# EAGLE design Pulsoxy (EAGLE 9.3.1)
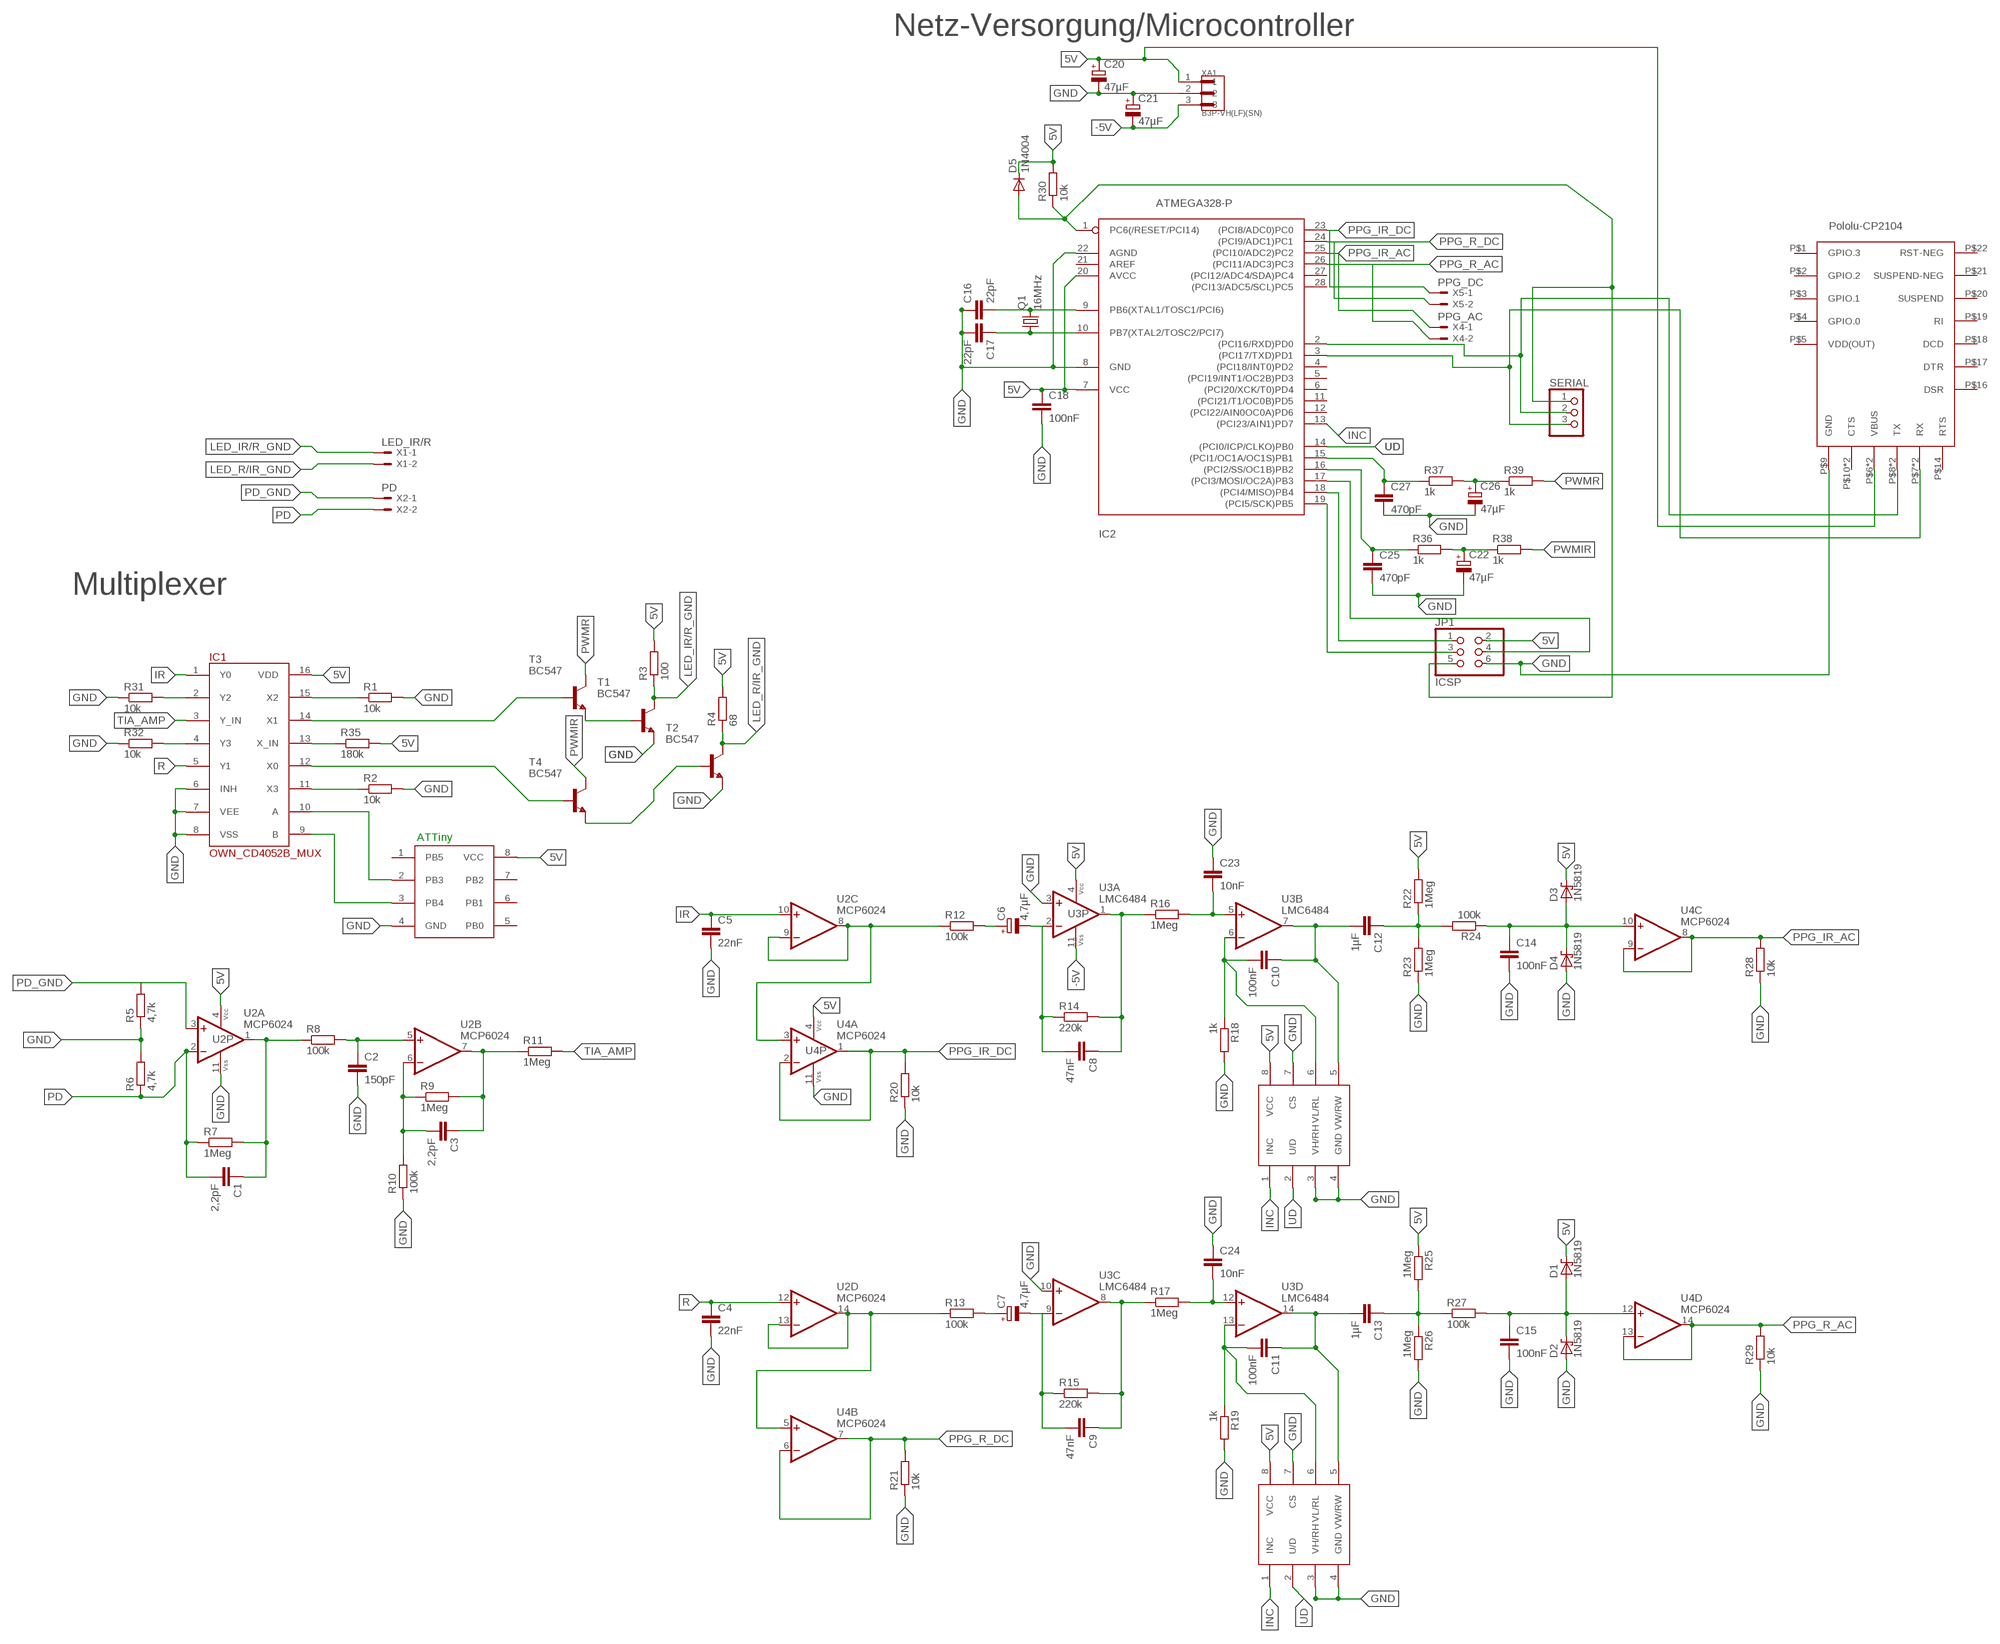
[diagram p0: schematic, sheet 1]

## Parts
ATTINY  ATTINY85  [DIL08]
C1  2,2pF  C-EU025-024X044  [C025-024X044]
C2  150pF  C-EU025-024X044  [C025-024X044]
C3  2,2pF  C-EU025-024X044  [C025-024X044]
C4  22nF  C-EU025-024X044  [C025-024X044]
C5  22nF  C-EU025-024X044  [C025-024X044]
C6  4,7µF  CPOL-EUE2-5  [E2-5]
C7  4,7µF  CPOL-EUE2-5  [E2-5]
C8  47nF  C-EU025-024X044  [C025-024X044]
C9  47nF  C-EU025-024X044  [C025-024X044]
C10  100nF  C-EU025-024X044  [C025-024X044]
C11  100nF  C-EU025-024X044  [C025-024X044]
C12  1µF  C-EU150-064X183  [C150-064X183]
C13  1µF  C-EU150-064X183  [C150-064X183]
C14  100nF  C-EU025-024X044  [C025-024X044]
C15  100nF  C-EU025-024X044  [C025-024X044]
C16  22pF  C-EU025-024X044  [C025-024X044]
C17  22pF  C-EU025-024X044  [C025-024X044]
C18  100nF  C-EU025-024X044  [C025-024X044]
C20  47µF  CPOL-EUE2,5-6E  [E2,5-6E]
C21  47µF  CPOL-EUE2,5-6E  [E2,5-6E]
C22  47µF  CPOL-EUE2,5-6E  [E2,5-6E]
C23  10nF  C-EU025-024X044  [C025-024X044]
C24  10nF  C-EU025-024X044  [C025-024X044]
C25  470pF  C-EU025-024X044  [C025-024X044]
C26  47µF  CPOL-EUE2,5-6E  [E2,5-6E]
C27  470pF  C-EU025-024X044  [C025-024X044]
D1  1N5819  SCHOTTKY-DIODEF126Z12  [F126Z12]
D2  1N5819  SCHOTTKY-DIODEF126Z12  [F126Z12]
D3  1N5819  SCHOTTKY-DIODEF126Z12  [F126Z12]
D4  1N5819  SCHOTTKY-DIODEF126Z12  [F126Z12]
D5  1N4004  [DO41-10]
IC1  OWN_CD4052B_MUX  [DIL16]
IC2  ATMEGA328-P  ATMEGA168-20P  [DIL28-3]
JP1  ICSP  PINHD-2X3  [2X03]
Q1  16MHz  CRYSTALHC49U70  [HC49U70]
R1  10k  R-EU_0204/7  [0204/7]
R2  10k  R-EU_0204/7  [0204/7]
R3  100  R-EU_0204/7  [0204/7]
R4  68  R-EU_0204/7  [0204/7]
R5  4,7k  R-EU_0204/7  [0204/7]
R6  4,7k  R-EU_0204/7  [0204/7]
R7  1Meg  R-EU_0204/7  [0204/7]
R8  100k  R-EU_0204/7  [0204/7]
R9  1Meg  R-EU_0204/7  [0204/7]
R10  100k  R-EU_0204/7  [0204/7]
R11  1Meg  R-EU_0204/7  [0204/7]
R12  100k  R-EU_0204/7  [0204/7]
R13  100k  R-EU_0204/7  [0204/7]
R14  220k  R-EU_0204/7  [0204/7]
R15  220k  R-EU_0204/7  [0204/7]
R16  1Meg  R-EU_0204/7  [0204/7]
R17  1Meg  R-EU_0204/7  [0204/7]
R18  1k  R-EU_0204/7  [0204/7]
R19  1k  R-EU_0204/7  [0204/7]
R20  10k  R-EU_0204/7  [0204/7]
R21  10k  R-EU_0204/7  [0204/7]
R22  1Meg  R-EU_0204/7  [0204/7]
R23  1Meg  R-EU_0204/7  [0204/7]
R24  100k  R-EU_0204/7  [0204/7]
R25  1Meg  R-EU_0204/7  [0204/7]
R26  1Meg  R-EU_0204/7  [0204/7]
R27  100k  R-EU_0204/7  [0204/7]
R28  10k  R-EU_0204/7  [0204/7]
R29  10k  R-EU_0204/7  [0204/7]
R30  10k  R-EU_0204/7  [0204/7]
R31  10k  R-EU_0204/7  [0204/7]
R32  10k  R-EU_0204/7  [0204/7]
R35  180k  R-EU_0204/7  [0204/7]
R36  1k  R-EU_0204/7  [0204/7]
R37  1k  R-EU_0204/7  [0204/7]
R38  1k  R-EU_0204/7  [0204/7]
R39  1k  R-EU_0204/7  [0204/7]
SERIAL  PINHD-1X3  [1X03]
T1  BC547  [TO92]
T2  BC547  [TO92]
T3  BC547  [TO92]
T4  BC547  [TO92]
U2  MCP6024  LMV824  [DIL14]
U3  LMC6484  LMV824  [DIL14]
U4  MCP6024  LMV824  [DIL14]
U$1  X9C104P  [DIL08]
U$2  X9C104P  [DIL08]
U$3  POLOLU_CP2104  [POLOLUCP2104]
X1  LED_IR/R  JST-XH-02-PIN-LONG-PAD  [JST-XH-02-PACKAGE-LONG-PAD]
X2  PD  JST-XH-02-PIN-LONG-PAD  [JST-XH-02-PACKAGE-LONG-PAD]
X4  PPG_AC  JST-XH-02-PIN-LONG-PAD  [JST-XH-02-PACKAGE-LONG-PAD]
X5  PPG_DC  JST-XH-02-PIN-LONG-PAD  [JST-XH-02-PACKAGE-LONG-PAD]
XA1  B3P-VH(LF)(SN)  [JST_B3P-VH(LF)(SN)]

## Nets
5V [supply]: ATTINY.8(VCC) C18.1 C20.+ D1.C D3.C D5.C IC1.16(VDD) IC2.7(VCC) IC2.20(AVCC) JP1.2 R3.2 R4.2 R22.2 R25.1 R30.2 R35.2 U2.4(P:VCC+) U3.4(P:VCC+) U4.4(P:VCC+) U$1.8(VCC) U$2.8(VCC) U$3.P$6(VBUS) U$3.P$11(VBUS) XA1.1
-5V [supply]: C21.- U3.11(P:VCC-) XA1.3
GND [supply]: ATTINY.4(GND) C2.2 C4.2 C5.2 C14.2 C15.2 C16.1 C17.2 C18.2 C20.- C21.+ C22.- C23.1 C24.1 C25.2 C26.- C27.2 D2.A D4.A IC1.6(INH) IC1.7(VEE) IC1.8(VSS) IC2.8(GND) IC2.22(AGND) JP1.6 R1.2 R2.2 R5.1 R6.2 R10.1 R18.2 R19.2 R20.1 R21.1 R23.1 R26.2 R28.1 R29.1 R31.1 R32.1 T1.1(E) T2.1(E) U2.11(P:VCC-) U3.3(A:+IN) U3.10(C:+IN) U4.11(P:VCC-) U$1.3(VH/RH) U$1.4(GND) U$1.7(CS) U$2.3(VH/RH) U$2.4(GND) U$2.7(CS) U$3.P$9(GND) XA1.2
INC: IC2.13((PCI23/AIN1)PD7) U$1.1(INC) U$2.1(INC)
IR: C5.1 IC1.1(Y0) U2.10(C:+IN)
LED_IR/R_GND: R3.1 T1.3(C) X1.1
LED_R/IR_GND: R4.1 T2.3(C) X1.2
N$1: IC1.11(X3) R2.1
N$2: IC1.15(X2) R1.1
N$3: IC1.14(X1) T3.2(B)
N$4: IC1.12(X0) T4.2(B)
N$5: C1.1 R7.2 R8.1 U2.1(A:OUT)
N$6: C2.1 R8.2 U2.5(B:+IN)
N$7: C3.2 R9.1 R10.2 U2.6(B:-IN)
N$8: C3.1 R9.2 R11.1 U2.7(B:OUT)
N$9: R12.1 U2.8(C:OUT) U2.9(C:-IN) U4.3(A:+IN)
N$10: R13.1 U2.13(D:-IN) U2.14(D:OUT) U4.5(B:+IN)
N$11: ATTINY.2(PB3) IC1.10(A)
N$12: ATTINY.3(PB4) IC1.9(B)
N$13: C7.- C9.2 R15.1 U3.9(C:-IN)
N$14: C8.1 R14.2 R16.1 U3.1(A:OUT)
N$15: C6.- C8.2 R14.1 U3.2(A:-IN)
N$16: C9.1 R15.2 R17.1 U3.8(C:OUT)
N$17: C13.1 R25.2 R26.1 R27.1
N$18: C14.1 D3.A D4.C R24.1 U4.10(C:+IN)
N$19: C10.2 R18.1 U3.6(B:-IN) U$1.6(VL/RL)
N$20: C15.1 D1.A D2.C R27.2 U4.12(D:+IN)
N$21: C11.2 R19.1 U3.13(D:-IN) U$2.6(VL/RL)
N$22: IC1.4(Y3) R32.2
N$23: C10.1 C12.2 U3.7(B:OUT) U$1.5(VW/RW)
N$24: C12.1 R22.1 R23.2 R24.2
N$25: C11.1 C13.2 U3.14(D:OUT) U$2.5(VW/RW)
N$26: C16.2 IC2.9(PB6(XTAL1/TOSC1/PCI6)) Q1.2
N$27: C17.1 IC2.10(PB7(XTAL2/TOSC2/PCI7)) Q1.1
N$28: IC2.2((PCI16/RXD)PD0) SERIAL.2 U$3.P$8(TX) U$3.P$12(TX)
N$29: D5.A IC2.1(PC6(/RESET/PCI14)) JP1.5 R30.1 SERIAL.1
N$30: IC2.18((PCI4/MISO)PB4) JP1.1
N$31: IC2.19((PCI5/SCK)PB5) JP1.3
N$32: IC2.17((PCI3/MOSI/OC2A)PB3) JP1.4
N$33: IC1.2(Y2) R31.2
N$35: IC2.3((PCI17/TXD)PD1) SERIAL.3 U$3.P$7(RX) U$3.P$13(RX)
N$42: C24.2 R17.2 U3.12(D:+IN)
N$43: IC1.13(X_IN) R35.1
N$44: C25.1 IC2.16((PCI2/SS/OC1B)PB2) R36.1
N$45: C23.2 R16.2 U3.5(B:+IN)
N$46: C7.+ R13.2
N$47: C6.+ R12.2
N$49: T1.2(B) T3.1(E)
N$50: T2.2(B) T4.1(E)
N$51: C22.+ R36.2 R38.1
N$52: C27.1 IC2.15((PCI1/OC1A/OC1S)PB1) R37.1
N$53: C26.+ R37.2 R39.1
PD: C1.2 R6.1 R7.1 U2.2(A:-IN) X2.2
PD_GND: R5.2 U2.3(A:+IN) X2.1
PPG_IR_AC: IC2.25((PCI10/ADC2)PC2) R28.2 U4.8(C:OUT) U4.9(C:-IN) X4.1
PPG_IR_DC: IC2.23((PCI8/ADC0)PC0) R20.2 U4.1(A:OUT) U4.2(A:-IN) X5.1
PPG_R_AC: IC2.26((PCI11/ADC3)PC3) R29.2 U4.13(D:-IN) U4.14(D:OUT) X4.2
PPG_R_DC: IC2.24((PCI9/ADC1)PC1) R21.2 U4.6(B:-IN) U4.7(B:OUT) X5.2
PWMIR: R38.2 T4.3(C)
PWMR: R39.2 T3.3(C)
R: C4.1 IC1.5(Y1) U2.12(D:+IN)
TIA_AMP: IC1.3(Y_IN) R11.2
UD: IC2.14((PCI0/ICP/CLKO)PB0) U$1.2(U/D) U$2.2(U/D)
Unconnected: ATTINY.1(PB5) ATTINY.5(PB0) ATTINY.6(PB1) ATTINY.7(PB2) IC2.4((PCI18/INT0)PD2) IC2.5((PCI19/INT1/OC2B)PD3) IC2.6((PCI20/XCK/T0)PD4) IC2.11((PCI21/T1/OC0B)PD5) IC2.12((PCI22/AIN0OC0A)PD6) IC2.21(AREF) IC2.27((PCI12/ADC4/SDA)PC4) IC2.28((PCI13/ADC5/SCL)PC5) U$3.P$1(GPIO.3) U$3.P$2(GPIO.2) U$3.P$3(GPIO.1) U$3.P$4(GPIO.0) U$3.P$10(CTS) U$3.P$14(RTS) U$3.P$15(CTS) U$3.P$16(DSR) U$3.P$17(DTR) U$3.P$18(DCD) U$3.P$19(RI) U$3.P$20(SUSPEND) U$3.P$21(SUSPEND-NEG) U$3.P$22(RST-NEG)

## Notes on the sheet
- Netz-Versorgung/Microcontroller
- Multiplexer
- ATTiny

## Power pins joined to a net without a drawn wire
VDD(OUT): U$3.P$5(VDD(OUT))

## Library data of the parts
ATTINY = ATTINY85:ATTINY85; SPICEPREFIX: X
C1-C5 C8-C18 C23-C25 C27 = rcl:C-EU: CAPACITOR, European symbol; SPICEPREFIX: C
C6 C7 C20-C22 C26 = rcl:CPOL-EU: POLARIZED CAPACITOR, European symbol; SPICEPREFIX: C
D1-D4 = diode:SCHOTTKY-DIODE: Schottky Diode
D5 = diode:1N4004: DIODE general purpose rectifier, 1 A
IC1 = OWN_CD4052B_MUX:OWN_CD4052B_MUX
IC2 = adafruit:ATMEGA168*P: MICROCONTROLLER 16 kBytes FLASH 1 kBytes SRAM 512 Bytes EEPROM USART 8-channel 10 bit ADC
JP1 = pinhead:PINHD-2X3: PIN HEADER
Q1 = adafruit:CRYSTAL: CRYSTAL; OC_FARNELL: unknown; OC_NEWARK: unknown
R1-R32 R35-R39 = rcl:R-EU_: RESISTOR, European symbol; SPICEPREFIX: R
SERIAL = pinhead:PINHD-1X3: PIN HEADER
T1-T4 = transistor:BC547: NPN TRANSISTOR
U2-U4 = op-amp:LMV824: OP-AMP - Low Voltage Rail-to-Rail
U$1 U$2 = X9C104P:X9C104P
U$3 = POLOLU_CP2104:POLOLU_CP2104: TTL zu USB Konverter
X1 X2 X4 X5 = Rembrandt Electronics - JST XH Connectors v1-0:JST-XH-02-PIN: JST XH Connector 2 Pin Wire to board connector. Pitch: 2,54 mm, (0.100") Number of pins: 2 Created by Rembrandt Electronics www.rembrandtelectronics.com
XA1 = B3P-VH_LF__SN_:B3P-VH(LF)(SN): VH Series 3 Position 3.96 mm Pitch Through Hole Crimp Locking Header; AVAILABILITY: Good; DESCRIPTION: VH Series 3 Position 3.96 mm Pitch Through Hole Crimp Locking Header; MF: JST; MP: B3P-VH_LF__SN_; PACKAGE: FakePackage u; PRICE: 0.12 USD

## Net classes
0 signals: width 0.406 mm, clearance 0.305 mm
1 supply: width 0.61 mm, clearance 0.406 mm

## Board
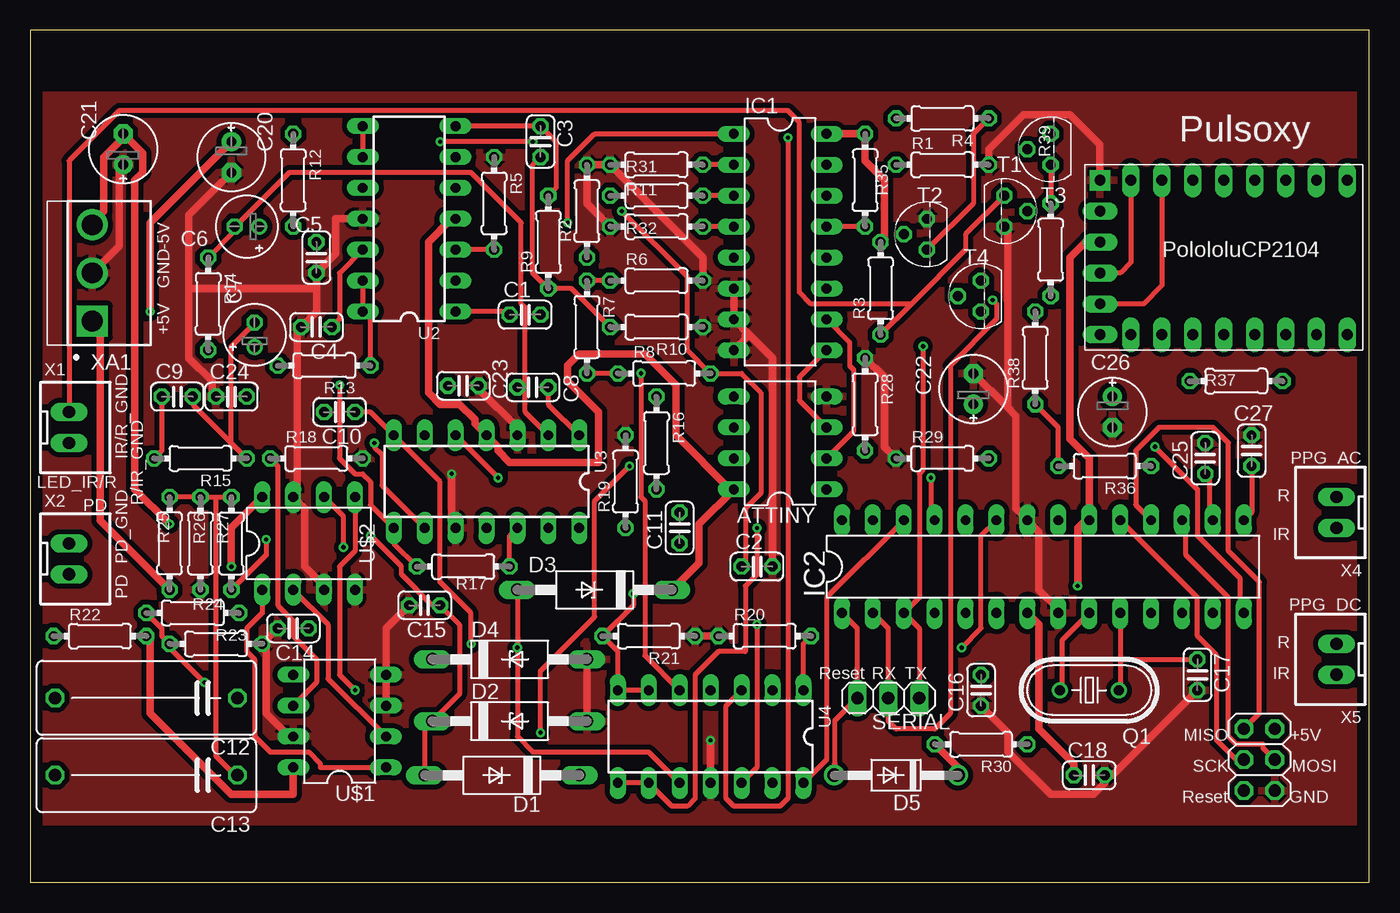
[diagram p1: board, top side]
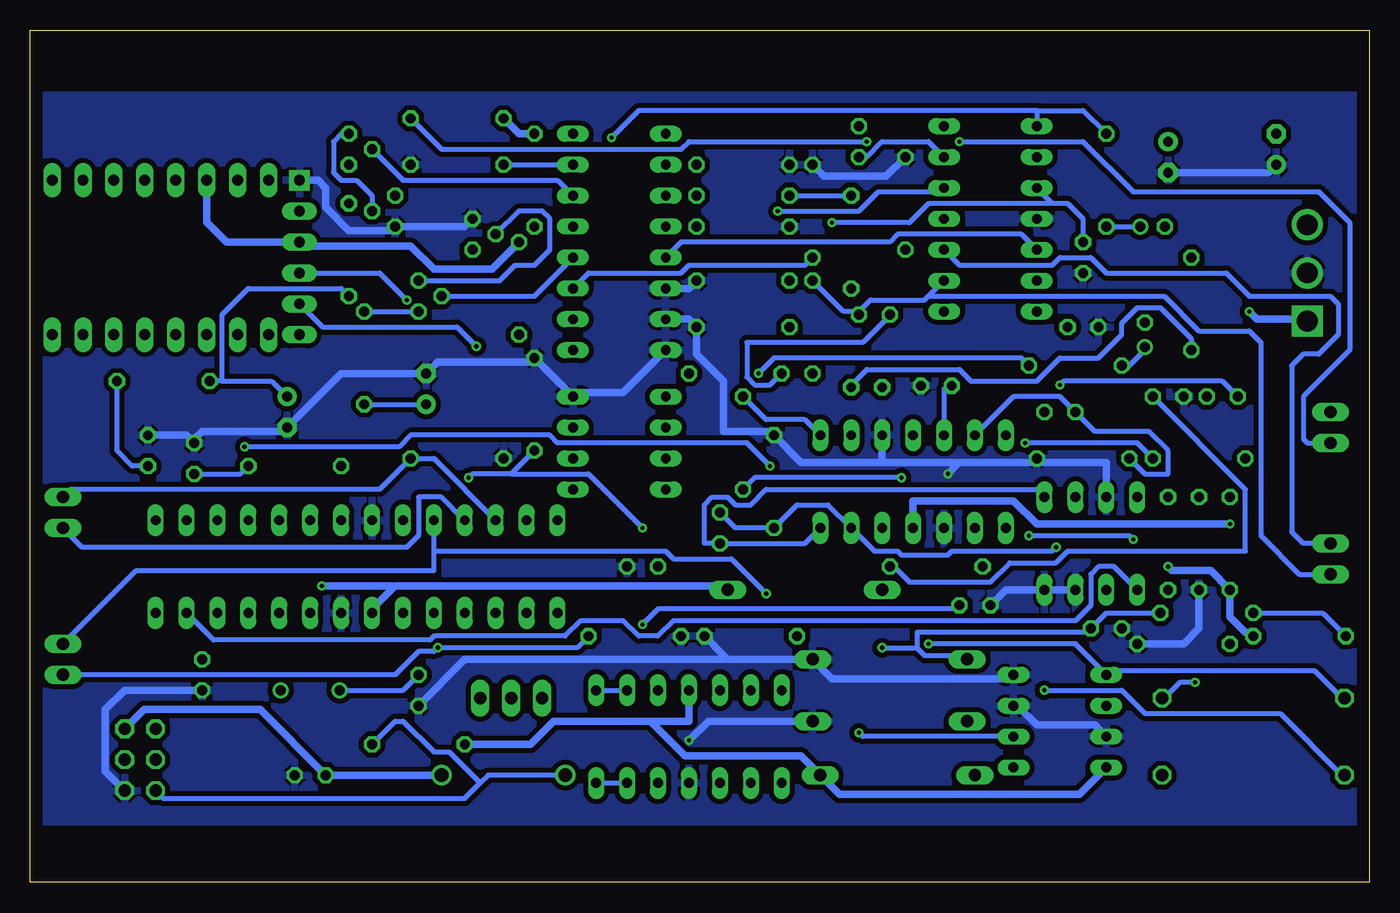
[diagram p2: board, bottom side, seen from below]

Size 109.98 x 70.01 mm. Coordinates in mm from the lower left corner, seen from the top.
Outline: 0,0 109.98,0 109.98,70.01 0,70.01 0,0
Copper layers (1*16): Top 0.035mm / dielectric 1.5mm / Bottom 0.035mm
Design rules "default": minimum track width 6mil, minimum drill 0.35mm, track to track 6mil, track to pad 6mil, pad to pad 6mil, via to via 6mil, smd to smd 6mil, copper to edge 40mil, drill to drill 6mil, minimum pad ring 10mil, minimum via ring 8mil, stop-mask expansion 4mil, vias tented up to drill 0mil, thermal gap 10mil

### Footprints (pad centres in the part's own frame; a part is rotated, then mirrored left to right if it is on the bottom)
DIL08 = drill 0.813 long: 1 -2.54,-3.81; 2 0,-3.81; 3 2.54,-3.81; 4 5.08,-3.81; 5 5.08,3.81; 6 2.54,3.81; 7 0,3.81; 8 -2.54,3.81
C025-024X044 = drill 0.813 octagon: 1 -1.27,0; 2 1.27,0
E2-5 = drill 0.813 pad 1.27: + -1.016,0 | drill 0.813 pad 1.27 octagon: - 1.016,0
C150-064X183 = drill 1.016 octagon: 1 -7.493,0; 2 7.493,0
E2,5-6E = drill 0.813 pad 1.575: + -1.27,0 | drill 0.813 pad 1.575 octagon: - 1.27,0
F126Z12 = drill 1.016 long: A 6.35,0; C -6.35,0
DO41-10 = drill 1.118: A 5.08,0; C -5.08,0
DIL16 = drill 0.813 long: 1 -8.89,-3.81; 2 -6.35,-3.81; 3 -3.81,-3.81; 4 -1.27,-3.81; 5 1.27,-3.81; 6 3.81,-3.81; 7 6.35,-3.81; 8 8.89,-3.81; 9 8.89,3.81; 10 6.35,3.81; 11 3.81,3.81; 12 1.27,3.81; 13 -1.27,3.81; 14 -3.81,3.81; 15 -6.35,3.81; 16 -8.89,3.81
DIL28-3 = drill 0.813 long: 1 -16.51,-3.81; 2 -13.97,-3.81; 3 -11.43,-3.81; 4 -8.89,-3.81; 5 -6.35,-3.81; 6 -3.81,-3.81; 7 -1.27,-3.81; 8 1.27,-3.81; 9 3.81,-3.81; 10 6.35,-3.81; 11 8.89,-3.81; 12 11.43,-3.81; 13 13.97,-3.81; 14 16.51,-3.81; 15 16.51,3.81; 16 13.97,3.81; 17 11.43,3.81; 18 8.89,3.81; 19 6.35,3.81; 20 3.81,3.81; 21 1.27,3.81; 22 -1.27,3.81; 23 -3.81,3.81; 24 -6.35,3.81; 25 -8.89,3.81; 26 -11.43,3.81; 27 -13.97,3.81; 28 -16.51,3.81
2X03 = drill 1.016 octagon: 1 -2.54,-1.27; 2 -2.54,1.27; 3 0,-1.27; 4 0,1.27; 5 2.54,-1.27; 6 2.54,1.27
HC49U70 = drill 0.813: 1 -2.413,0; 2 2.413,0
0204/7 = drill 0.813 octagon: 1 -3.81,0; 2 3.81,0
1X03 = drill 1.016 long: 1 -2.54,0; 2 0,0; 3 2.54,0
TO92 = drill 0.813 octagon: 1 1.27,0; 2 0,1.905; 3 -1.27,0
DIL14 = drill 0.813 long: 1 -7.62,-3.81; 2 -5.08,-3.81; 3 -2.54,-3.81; 4 0,-3.81; 5 2.54,-3.81; 6 5.08,-3.81; 7 7.62,-3.81; 8 7.62,3.81; 9 5.08,3.81; 10 2.54,3.81; 11 0,3.81; 12 -2.54,3.81; 13 -5.08,3.81; 14 -7.62,3.81
POLOLUCP2104 = drill 0.9 pad 1.422 long: P$1 1.27,-1.27; P$2 1.27,-3.81; P$3 1.27,-6.35; P$4 1.27,-8.89; P$5 1.27,-11.43; P$6 1.27,-13.97; P$7 1.27,-16.51; P$8 1.27,-19.05; P$10 3.81,-21.59; P$11 6.35,-21.59; P$12 8.89,-21.59; P$13 11.43,-21.59; P$14 13.97,-21.59; P$15 13.97,-19.05; P$16 13.97,-16.51; P$17 13.97,-13.97; P$18 13.97,-11.43; P$19 13.97,-8.89; P$20 13.97,-6.35; P$21 13.97,-3.81; P$22 13.97,-1.27 | drill 0.9 pad 1.676 square: P$9 1.27,-21.59
JST-XH-02-PACKAGE-LONG-PAD = drill 1.016 long: 1 -1.27,0; 2 1.27,0
JST_B3P-VH(LF)(SN) = drill 1.7 square: 1 -3.96,0 | drill 1.7: 2 0,0; 3 3.96,0

### Placement (x,y rotation side)
ATTINY  61.59,34.84 90 top
C1  40.64,46.65 0 top
C2  59.69,25.95 0 top
C3  41.91,60.88 270 top
C4  23.5,45.64 180 top
C5  23.5,51.35 270 top
C6  17.78,53.89 180 top
C7  18.41,45 90 top
C8  41.27,40.69 180 top
C9  12.06,39.92 0 top
C10  25.4,38.65 180 top
C11  53.34,29.13 90 top
C12  9.53,15.16 180 top
C13  9.53,8.81 180 top
C14  21.59,20.87 180 top
C15  32.38,22.78 180 top
C16  78.11,15.79 90 top
C17  95.89,17.06 270 top
C18  87,8.81 0 top
C20  16.51,59.61 270 top
C21  7.62,60.24 90 top
C22  77.47,40.56 90 top
C23  35.56,40.81 180 top
C24  16.51,39.92 0 top
C25  96.52,34.84 90 top
C26  88.9,38.65 270 top
C27  100.33,35.48 90 top
D1  38.73,8.81 180 top
D2  39.37,13.25 0 top
D3  46.35,24.05 180 top
D4  39.37,18.33 0 top
D5  71.12,8.81 180 top
IC1  61.59,52.62 270 top
IC2  83.19,25.95 0 top
JP1  100.97,10.08 270 top
Q1  87,15.79 180 top
R1  74.93,58.97 0 top
R2  45.72,55.16 90 top
R3  69.85,48.81 90 top
R4  74.93,62.78 180 top
R5  38.1,55.8 270 top
R6  51.44,49.45 0 top
R7  45.72,45.64 270 top
R8  52.07,41.83 0 top
R9  42.55,52.62 90 top
R10  51.44,45.64 180 top
R11  51.44,56.43 0 top
R12  21.59,57.7 270 top
R13  24.13,42.46 180 top
R14  14.61,47.54 270 top
R15  13.97,34.84 180 top
R16  51.44,36.11 270 top
R17  35.56,25.95 0 top
R18  23.5,34.84 0 top
R19  48.9,32.94 90 top
R20  60.33,20.24 0 top
R21  50.8,20.24 180 top
R22  5.71,20.24 0 top
R23  15.24,19.6 180 top
R24  13.34,22.14 180 top
R25  11.43,27.86 90 top
R26  13.97,27.86 270 top
R27  16.51,27.86 270 top
R28  68.58,39.29 270 top
R29  74.93,34.84 0 top
R30  78.11,11.35 180 top
R31  51.44,58.97 0 top
R32  51.44,53.89 0 top
R35  68.58,57.7 90 top
R36  88.27,34.21 180 top
R37  99.06,41.19 180 top
R38  82.55,43.1 90 top
R39  83.82,51.99 90 top
SERIAL  70.48,15.16 0 top
T1  80.01,55.16 270 top
T2  73.66,53.26 90 top
T3  83.82,60.24 90 top
T4  78.11,48.18 90 top
U2  31.11,54.53 90 top
U3  37.47,32.94 180 top
U4  55.88,11.98 180 top
U$1  25.4,11.98 90 top
U$2  21.59,27.86 0 top
U$3  109.47,58.97 270 top
X1  3.17,37.38 270 top
X2  3.17,26.59 270 top
X4  107.31,30.4 90 top
X5  107.31,18.33 90 top
XA1  5.08,50.08 90 top

### Tracks (layer width: path | path; a pad name or v marks a point on that pad's centre or on a via)
5V  (via drill 0.35)
  Top 0.61: IC1.16 R35.2 68.58,59.29 70.17,57.7 70.17,52.94 R3.2 | U$3.P$11 86.68,52.62 85.41,51.35 85.41,36.43 87,34.84 IC2.20 86.68,29.76 86.04,29.13 v86.04,24.37 | U$2.8 16.51,29.13 v16.51,25.95 | C20.+ 9.84,54.21 v9.84,46.91 | R25.1 5.71,29.76 5.71,45.32 5.08,45.96 XA1.1 | U2.4 34.61,54.53 32.7,52.62 32.7,40.24 33.66,39.29 35.24,39.29 36.51,38.02 36.51,37.7 U3.4 38.42,35.8 38.42,35.48 39.37,34.53 46.67,34.53 46.67,38.65 44.13,41.19 44.13,42.46 45.09,43.42 50.48,43.42 53.02,40.88 53.02,36.75 57.47,32.3 ATTINY.8 54.93,29.45 54.93,26.27 D3.C | IC2.7 82.87,21.19 82.87,12.62 85.72,9.76 C18.1 | R30.2 76.2,9.44 D5.C | R22.2 9.84,19.92 9.84,13.89 16.51,7.22 21.59,7.22 U$1.8
  Bottom 0.61: R4.2 69.85,61.51 R35.2 | U$3.P$6 95.5,54.27 93.85,52.62 U$3.P$11 87.57,52.31 78.74,52.31 76.83,50.4 72.07,50.4 R3.2 | R22.2 9.84,20.56 10.16,20.56 11.43,21.83 R25.1 13.02,25.64 16.19,25.64 v16.51,25.95 | v9.84,46.91 9.21,46.27 5.08,46.27 XA1.1 | U$1.8 23.81,7.22 43.5,7.22 D1.C 46.67,10.4 56.2,10.4 59.05,13.25 | U4.4 55.88,13.25 59.05,13.25 | 59.05,13.25 66.99,13.25 68.9,11.35 R30.2 | D5.C C18.1 91.12,14.21 100.65,14.21 JP1.2 | D3.C 53.02,24.37 80.01,24.37 80.17,24.21 | 80.17,24.21 81.92,22.46 IC2.7 | v86.04,24.37 80.33,24.37 80.17,24.21
-5V  (via drill 0.35)
  Top 0.61: v11.43,29.45 8.57,32.3 8.57,57.7 9.21,58.34 9.21,59.93 C21.- 7.62,61.2 6.03,59.61 6.03,55.16 5.08,54.21 XA1.3
  Bottom 0.61: U3.11 37.47,31.35 29.21,31.35 27.3,29.45 v11.43,29.45
GND  (via drill 0.35)
  Top 0.61: R32.1 45.72,55.8 R2.2 R31.1 55.24,51.35 R6.2 | C2.2 60.96,43.1 58.9,45.16 | 58.9,45.16 IC1.7 IC1.6 | IC1.8 58.74,44.69 58.74,45 58.9,45.16 | R1.2 78.74,60.24 81.6,63.1 85.41,63.1 87.88,60.62 U$3.P$9 | IC2.8 84.45,22.46 82.87,24.05 82.87,28.81 IC2.22 80.96,30.72 80.96,38.34 80.17,39.13 | R29.1 70.17,35.8 70.17,41.51 R28.1 | C22.- 80.17,39.13 | T1.1 80.33,53.58 80.33,39.29 80.17,39.13 | 23.5,48.81 C5.2 25.08,51.67 25.08,54.53 U2.11 | 23.5,48.81 23.5,46.91 C4.2 21.91,45.32 21.91,31.67 U$2.7 22.54,30.72 22.54,25.95 24.13,24.37 U$2.3 | C24.1 14.92,40.24 14.92,41.19 13.02,43.1 13.02,48.81 | 13.02,48.81 13.02,54.85 C20.- | XA1.2 7.3,52.31 7.3,58.66 C21.+ | 13.02,48.81 23.5,48.81 | U3.10 34.61,29.45 v34.61,33.57 | U3.3 40.01,37.38 36.83,40.56 C23.1 | C17.2 88.9,8.81 C18.2 88.27,8.17 87.31,7.22 83.82,7.22 80.33,10.71 80.33,12.3 C16.1 | R20.1 R21.1 | v55.88,11.67 U4.11 | D2.A D4.A | C14.2 R23.1 19.37,19.6 19.37,13.89 21.27,11.98 U$1.7 | U$1.3 U$1.4 29.21,20.87 C15.2
  Bottom 0.61: R5.1 39.69,58.02 44.77,58.02 R2.2 | IC1.7 55.88,46.27 R10.1 55.24,43.42 53.02,41.19 53.02,37.07 49.21,37.07 R19.2 46.67,34.53 40.01,34.53 | R6.2 55.88,48.81 IC1.6 | T2.1 74.3,53.89 T1.1 80.33,53.58 83.82,53.58 85.72,55.48 85.72,57.07 86.36,57.7 U$3.P$9 | C27.2 97.16,36.75 C25.2 96.52,36.43 95.89,37.07 89.22,37.07 C26.- 84.45,41.83 C22.- 76.52,42.78 68.58,42.78 R28.1 ATTINY.4 65.41,40.24 61.28,40.24 IC1.8 | C21.+ 8.26,58.34 C20.- | 33.81,34.37 33.66,34.53 27.62,34.53 R18.2 27.3,34.53 21.59,34.53 U$2.7 | 33.81,34.37 v34.61,33.57 | 40.01,34.53 U3.3 | 40.01,34.53 33.97,34.53 33.81,34.37 | JP1.6 103.82,9.13 103.82,14.21 102.23,15.79 C17.2 | v55.88,11.67 54.29,13.25 D2.A | 52.86,18.49 52.7,18.33 D4.A 44.13,16.75 29.53,16.75 U$1.4 | 52.86,18.49 R21.1 | R23.1 15.24,19.6 13.97,20.87 R26.2 | U$2.3 U$2.4 29.84,24.05 C15.2 | U$1.7 22.54,12.94 27.3,12.94 28.89,14.52 U$1.3 | C16.1 74.3,18.33 53.02,18.33 52.86,18.49
  pour Top: 0,5 110.49,5 110.49,64.69 0,64.69
  pour Bottom: 0,5 110.49,5 110.49,64.69 0,64.69
INC
  Top 0.406: U$1.1 23.81,9.44 23.81,9.76 22.86,10.71 19.68,10.71 18.41,11.98 18.41,18.33 17.78,18.97 17.78,20.87 19.05,22.14 U$2.1
  Bottom 0.406: IC2.13 94.93,19.92 77.15,19.92 76.83,20.24 66.04,20.24 64.77,21.51 61.28,21.51 60.01,20.24 58.42,20.24 57.15,21.51 24.13,21.51 22.86,22.78 22.86,25.32 22.23,25.95 20.95,25.95 U$2.1
IR  (via drill 0.35)
  Top 0.406: v44.13,54.21 44.13,59.29 46.35,61.51 IC1.1
  Bottom 0.406: C5.1 23.5,54.53 24.77,55.8 26.04,55.8 | U2.10 26.04,55.8 | v44.13,54.21 37.78,54.21 36.2,55.8 26.04,55.8
LED_IR/R_GND
  Top 0.406: 72.39,47.54 76.83,51.99 76.83,53.26 T1.3 | 72.39,47.54 R3.1 | X1.1 3.17,59.29 7.3,63.42 62.23,63.42 63.18,62.47 63.18,48.5 64.14,47.54 72.39,47.54
LED_R/IR_GND  (via drill 0.35)
  Top 0.406: T2.3 77.47,55.8 77.47,61.51 R4.1 | v41.27,60.88 v33.66,60.88
  Bottom 0.406: X1.2 5.08,36.11 5.4,36.43 5.4,39.92 1.59,43.73 1.59,54.21 4.13,56.75 19.37,56.75 23.5,60.88 v33.66,60.88 | v41.27,60.88 55.88,60.88 56.52,60.24 76.2,60.24 R4.1
N$1
  Bottom 0.406: R2.1 46.35,50.72 55.88,50.72 56.52,50.08 64.14,50.08 IC1.11
N$2
  Bottom 0.406: R1.1 IC1.15
N$3
  Bottom 0.406: IC1.14 66.67,57.7 79.38,57.7 T3.2
N$4
  Bottom 0.406: IC1.12 68.58,48.18 T4.2
N$5
  Top 0.406: R8.1 R7.2 | U2.1 39.37,46.91 C1.1
  Bottom 0.406: R8.1 49.21,40.88 50.48,40.88 51.12,41.51 51.12,44.37 41.59,44.37 39.37,46.59 C1.1
N$6  (via drill 0.35)
  Top 0.406: C2.1 58.74,26.27 58.74,30.72 60.01,31.99 60.01,40.24 58.42,41.83 R8.2 53.98,43.73 53.98,49.77 v48.58,55.16
  Bottom 0.406: U2.5 35.24,56.75 40.32,56.75 41.91,55.16 v48.58,55.16
N$7
  Top 0.406: R10.2 44.45,48.81 R9.1 41.27,50.08 41.27,58.97 C3.2
  Bottom 0.406: U2.6 36.2,60.88 40.01,60.88 41.27,59.61 C3.2
N$8
  Top 0.406: U2.7 C3.1 43.18,60.88 43.18,57.07 R9.2
  Bottom 0.406: R11.1 R9.2
N$9  (via drill 0.35)
  Top 0.406: U2.8 U2.9 | U4.3 57.15,14.52 57.15,6.9 57.78,6.27 61.59,6.27 62.23,6.9 v62.23,61.2
  Bottom 0.406: v62.23,61.2 60.01,63.42 27.3,63.42 | 27.3,63.42 23.5,63.42 R12.1 | 27.3,63.42 U2.8
N$10  (via drill 0.35)
  Top 0.406: U2.13 U2.14 27.94,46.27 R13.1 | U4.5 50.48,18.65 50.48,31.35 50.16,31.67 v50.16,41.83
  Bottom 0.406: v50.16,41.83 48.9,43.1 28.57,43.1 R13.1
N$11
  Top 0.406: ATTINY.2 67.63,37.07 67.63,42.15 67.31,42.46 67.31,44.37 IC1.10
N$12
  Top 0.406: ATTINY.3 63.18,39.61 63.18,41.51 IC1.9
N$13  (via drill 0.35)
  Top 0.406: 16.51,36.11 13.34,39.29 C9.2 | 16.51,36.11 R15.1 | U3.9 28.89,32.62 28.89,35.16 28.26,35.8 v28.26,36.11 | 16.51,36.11 16.51,44.05 18.41,45.96 C7.-
  Bottom 0.406: v28.26,36.11 19.05,36.11 R15.1
N$14
  Top 0.406: U3.1 42.55,39.29 C8.1
  Bottom 0.406: R14.2 14.61,44.69 17.14,47.23 19.05,47.23 20.32,45.96 20.32,45 22.23,43.1 25.4,43.1 27.3,41.19 32.7,41.19 33.66,42.15 41.27,42.15 42.55,40.88 C8.1 | R16.1 49.53,38.02 46.35,38.02 U3.1
N$15
  Top 0.406: R14.1 16.51,53.26 16.51,53.89 C6.- 16.83,53.89 21.27,58.34 36.2,58.34 40.32,54.21 40.32,47.54 40.64,47.23 40.64,40.56 40.64,38.65 U3.2
  Top 0.61: C8.2 40.13,40.56 40.64,40.56
N$16  (via drill 0.35)
  Top 0.406: R17.1 29.84,27.86 U3.8 27.94,31.03 27.94,32.94 27.3,33.57 26.67,33.57 25.4,34.84 v25.4,40.88 | R15.2 10.79,35.48 C9.1
  Bottom 0.406: v25.4,40.88 25.08,41.19 12.06,41.19 C9.1
N$17
  Top 0.406: R25.2 R26.1 15.24,31.67 | 15.24,31.67 R27.1 | 15.24,31.67 15.24,10.4 16.83,8.81 C13.1
N$18  (via drill 0.35)
  Top 0.406: U4.10 50.8,10.71 41.27,10.71 40.01,11.98 v40.01,19.29 D3.A
  Bottom 0.406: R24.1 21.59,22.14 C14.1 23.18,20.56 37.15,20.56 37.15,19.29 | D4.C 33.34,18.65 36.51,18.65 37.15,19.29 | v40.01,19.29 37.15,19.29
N$19
  Top 0.406: U$1.6 23.5,16.43 23.5,18.33 21.59,20.24 21.59,21.51 20.32,22.78 20.32,34.21 R18.1
  Bottom 0.406: U3.6 29.21,39.92 25.4,39.92 C10.2 22.54,37.07 18.1,37.07 16.51,35.48 16.51,33.57 18.41,33.57 R18.1
N$20  (via drill 0.35)
  Top 0.406: D1.A 32.38,12.62 D2.C 35.24,15.48 35.24,21.19 C15.1 33.02,22.78 30.48,25.32 30.48,25.95 v27.94,28.49 | R27.2 19.37,26.91 v19.37,28.18 | U4.12 59.69,9.44 v59.69,21.19
  Bottom 0.406: v19.37,28.18 19.68,28.49 v27.94,28.49 | v59.69,21.19 58.42,22.46 33.97,22.46 C15.1
N$21  (via drill 0.35)
  Top 0.406: U$2.6 25.72,30.08 v25.72,27.54
  Bottom 0.406: v25.72,27.54 26.04,27.22 34.29,27.22 34.61,26.91 38.42,26.91 38.73,27.22 40.64,27.22 U3.13 44.45,31.03 46.99,31.03 R19.1 52.07,29.13 C11.2
N$22
  Top 0.406: IC1.4 R32.2
N$23  (via drill 0.35)
  Top 0.406: C10.1 27.94,38.65 U3.7 33.66,32.94 33.66,24.68 36.2,22.14 v36.2,19.6
  Bottom 0.406: C12.2 2.22,15.16 4.45,17.38 21.27,17.38 U$1.5 24.13,19.6 v36.2,19.6
N$24  (via drill 0.35)
  Top 0.406: R24.2 10.79,20.87 10.79,20.24 R23.2 11.43,19.29 v14.29,16.43
  Bottom 0.406: R22.1 3.81,22.14 R24.2 | v14.29,16.43 15.56,16.43 16.83,15.16 C12.1
N$25  (via drill 0.35)
  Top 0.406: v26.67,15.79 25.4,17.06 25.4,25.95 26.67,27.22 U$2.5
  Bottom 0.406: U$2.5 27.3,32.3 49.53,32.3 50.8,31.03 52.07,31.03 52.7,31.67 53.98,31.67 54.61,31.03 54.61,27.86 C11.1 46.35,27.86 U3.14 | v26.67,15.79 20.32,15.79 18.41,13.89 7.3,13.89 2.22,8.81 C13.2
N$26
  Top 0.406: IC2.9 84.77,19.92 84.77,15.79 Q1.2
  Bottom 0.406: C16.2 79.38,15.79 Q1.2
N$27
  Top 0.406: IC2.10 89.53,18.33 | 89.53,18.33 89.53,15.79 Q1.1 | 89.53,18.33 C17.1
N$28  (via drill 0.35)
  Top 0.406: U$3.P$8 90.42,50.97 89.53,50.08 U$3.P$12 | v79.06,47.86 79.38,47.54 79.38,46.27 75.56,42.46 75.56,13.89 74.3,12.62 71.12,12.62 70.48,13.25 SERIAL.2 70.48,20.87 IC2.2
  Bottom 0.406: v79.06,47.86 81.28,50.08 U$3.P$12
N$29
  Top 0.406: 66.36,9.13 D5.A 66.04,9.71 66.12,9.78 66.12,13.33 SERIAL.1 67.94,20.87 IC2.1
  Bottom 0.406: R30.1 80.01,13.25 79.38,13.25 76.83,10.71 75.56,10.71 73.03,8.17 | 73.03,8.17 74.3,6.9 99.06,6.9 JP1.5 | 73.03,8.17 72.39,8.81 D5.A
N$30
  Top 0.406: IC2.18 90.81,31.03 90.81,35.48 92.71,37.38 97.16,37.38 98.42,36.11 98.42,27.22 100.97,24.68 100.97,13.89 JP1.1
N$31
  Top 0.406: IC2.19 95.89,23.41 95.89,20.24 97.47,18.65 97.47,11.67 99.06,10.08 JP1.3
N$32
  Top 0.406: IC2.17 94.93,29.45 94.93,26.91 98.42,23.41 98.42,11.98 99.06,11.35 101.28,11.35 101.28,11.03 JP1.4
N$33
  Top 0.406: IC1.2 R31.2
N$35  (via drill 0.35)
  Top 0.406: U$3.P$7 92.96,49.07 91.44,47.54 U$3.P$13 | v73.34,44.05 73.34,33.89 73.03,33.57 73.03,23.41 IC2.3 73.03,20.87 SERIAL.3
  Bottom 0.406: v73.34,44.05 74.93,45.64 85.98,45.64 U$3.P$13
N$42
  Top 0.406: U3.12 39.37,28.49 R17.2
  Bottom 0.406: C24.2 10.16,32.3 10.16,27.22 24.77,27.22 25.72,26.27 29.53,26.27 31.11,24.68 37.78,24.68 39.05,25.95 R17.2
N$43
  Top 0.406: R35.1 IC1.13
N$44
  Top 0.406: IC2.16 96.84,30.08 96.84,33.26 C25.1
  Bottom 0.406: R36.1 92.71,33.57 C25.1
N$45  (via drill 0.35)
  Top 0.406: U3.5 v38.42,33.26
  Bottom 0.406: U3.5 34.92,40.56 34.29,40.56 C23.2 | R16.2 50.48,33.26 v38.42,33.26
N$46
  Bottom 0.406: R13.2 19.68,42.46 18.41,43.73 C7.+
N$47
  Bottom 0.406: R12.2 C6.+
N$49
  Bottom 0.406: T1.2 81.92,56.43 83.19,57.7 84.45,57.7 85.09,58.34 85.09,60.88 84.45,61.51 T3.1
N$50
  Bottom 0.406: T2.2 69.85,55.16 67.94,55.16 67.31,54.53 67.31,51.99 68.58,50.72 70.17,50.72 71.44,49.45 T4.1
N$51
  Top 0.406: R38.1 84.45,37.38 R36.2
  Bottom 0.406: R38.1 C22.+
N$52
  Top 0.406: IC2.15 100.33,30.4 C27.1
  Bottom 0.406: C27.1 101.6,34.21 102.87,35.48 R37.1
N$53
  Bottom 0.406: R39.1 84.45,48.81 92.08,48.81 94.23,46.65 94.23,41.19 | C26.+ 90.17,41.19 94.23,41.19 | 94.23,41.19 R37.2
PD
  Top 0.406: R6.1 R7.1
  Bottom 0.406: 36.2,48.18 36.51,47.86 40.96,47.86 41.91,46.91 | 36.2,48.18 U2.2 | X2.2 5.71,25.32 8.89,28.49 8.89,44.37 9.84,45.32 13.97,45.32 16.83,48.18 36.2,48.18 | R7.1 43.18,46.91 41.91,46.91 | 41.91,46.91 C1.2
PD_GND
  Top 0.406: R5.2 U2.3
  Bottom 0.406: X2.1 5.4,27.86 6.35,28.81 6.35,42.46 5.4,43.42 4.13,43.42 2.54,45 2.54,47.54 3.17,48.18 9.84,48.18 11.75,50.08 21.59,50.08 22.86,51.35 25.4,51.35 26.04,50.72 33.66,50.72 U2.3
PPG_IR_AC  (via drill 0.35)
  Top 0.406: U4.8 U4.9 52.7,6.27 53.98,6.27 54.61,6.9 54.61,17.06 56.52,18.97 58.74,18.97 58.74,24.37 59.69,25.32 v59.69,29.13 | IC2.25 73.98,30.08 v73.98,33.26
  Bottom 0.406: v73.98,33.26 73.66,33.57 70.48,33.57 | R28.2 70.48,33.57 | X4.1 105.73,27.54 79.06,27.54 78.11,28.49 78.11,31.67 76.2,31.67 IC2.25 | v59.69,29.13 64.14,33.57 70.48,33.57
PPG_IR_DC  (via drill 0.35)
  Top 0.406: R20.2 63.5,19.6 U4.1 | IC2.23 78.11,28.49 78.11,20.87 v76.52,19.29
  Bottom 0.406: U4.1 U4.2 | R20.2 65.09,19.29 v76.52,19.29 76.83,18.97 78.11,18.97 80.01,17.06 X5.1
PPG_R_AC
  Top 0.406: U4.14 65.41,10.08 65.41,23.41 IC2.26
  Bottom 0.406: U4.14 U4.13 | IC2.26 76.83,34.84 R29.2 81.28,32.3 106.68,32.3 X4.2
PPG_R_DC  (via drill 0.35)
  Top 0.406: U4.6 U4.7 48.26,18.97 R21.2 49.53,22.78 v49.53,23.73
  Bottom 0.406: 76.83,27.22 76.83,25.64 101.28,25.64 X5.2 | 76.83,27.22 IC2.24 | v49.53,23.73 52.39,26.59 57.15,26.59 57.78,27.22 76.83,27.22
PWMIR
  Bottom 0.406: R38.2 T4.3
PWMR
  Top 0.406: T3.3 R39.2
R
  Top 0.406: C4.1 25.4,46.27 25.4,50.08 U2.12
  Bottom 0.406: IC1.5 56.52,52.62 39.37,52.62 38.73,53.26 28.57,53.26 U2.12
TIA_AMP
  Top 0.406: IC1.3 R11.2
UD  (via drill 0.35)
  Top 0.406: U$1.2 24.45,16.75 24.45,21.19 U$2.2 | IC2.14 99.38,22.46 99.38,25 95.89,28.49 95.89,32.3 v92.39,35.8 | v49.21,34.21 46.35,31.35 46.35,21.83 41.91,17.38 v41.91,12.3
  Bottom 0.406: v92.39,35.8 79.69,35.8 78.74,36.75 67.31,36.75 66.67,36.11 51.12,36.11 v49.21,34.21 | v41.91,12.3 41.59,11.98 U$1.2

### Text on the board
tNames: Pulsoxy | -5V | GND | +5V | IR/R_GND | R/IR_GND | PD_GND | R | IR | PD | R | Reset | RX | TX | IR | MISO | +5V | SCK | MOSI | Reset | GND